# EAGLE design Encoder (EAGLE 6.5.0)
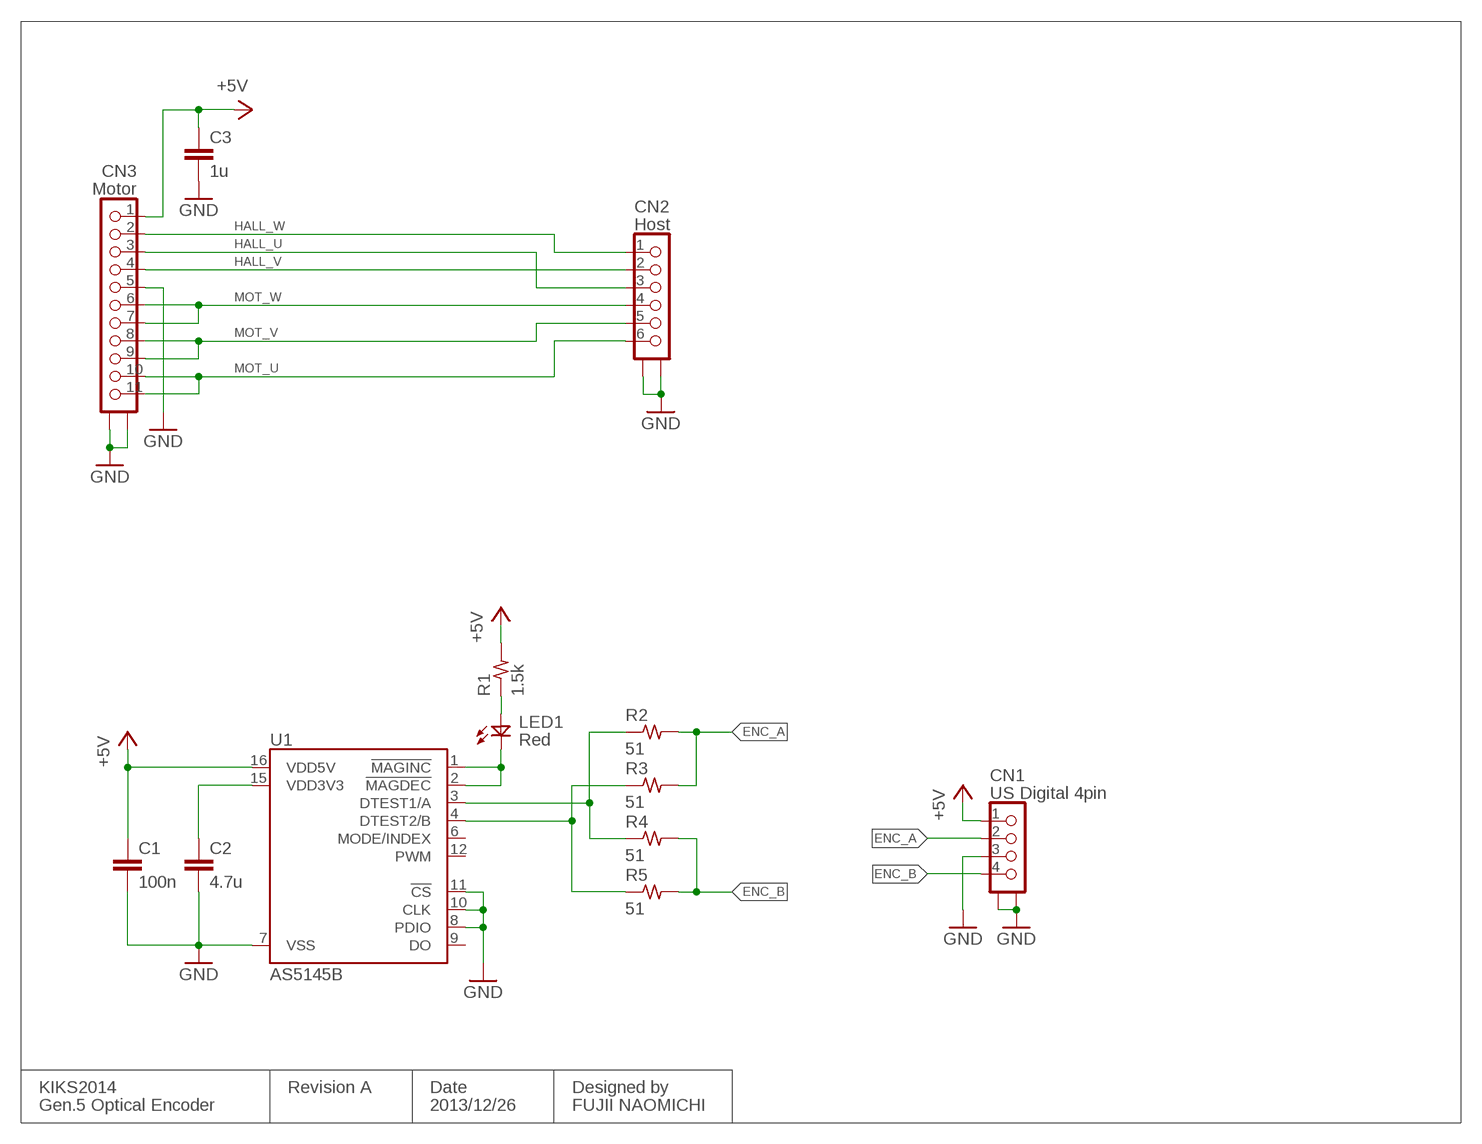
[diagram p0: schematic, sheet 1]

## Parts
C1  100n  C1608  [1608]
C2  4.7u  C1608  [1608]
C3  1u  C1608  [1608]
CN1  US Digital 4pin  53261-0471  [53261-04]
CN2  Host  504050-0691  [504050-0691]
CN3  Motor  52271-1179  [52271-11]
LED1  Red  LED1608  [1608]
R1  1.5k  R1608  [1608]
R2  51  R1608  [1608]
R3  51  R1608  [1608]
R4  51  R1608  [1608]
R5  51  R1608  [1608]
U1  AS5145B  [SSOP16]

## Nets
+5V: C1.1 C3.1 CN1.1 CN3.1 R1.2 U1.16(VDD5V)
ENC_A: CN1.2 R2.2 R3.2
ENC_B: CN1.4 R4.2 R5.2
GND: C1.2 C2.2 C3.2 CN1.3 CN1.S1 CN1.S2 CN2.S1 CN2.S2 CN3.5 CN3.S1 CN3.S2 U1.7(VSS) U1.8(PDIO) U1.10(CLK) U1.11(!CS)
HALL_U: CN2.3 CN3.3
HALL_V: CN2.2 CN3.4
HALL_W: CN2.1 CN3.2
MOT_U: CN2.6 CN3.10 CN3.11
MOT_V: CN2.5 CN3.8 CN3.9
MOT_W: CN2.4 CN3.6 CN3.7
N$1: R2.1 R4.1 U1.3(DTEST1/A)
N$2: C2.1 U1.15(VDD3V3)
N$3: R3.1 R5.1 U1.4(DTEST2/B)
N$5: LED1.K U1.1(!MAGINC) U1.2(!MAGDEC)
N$6: LED1.A R1.1
Unconnected: U1.6(MODE/INDEX) U1.9(DO) U1.12(PWM)

## Notes on the sheet
- KIKS2014 | Revision A | Date | Designed by
- Gen.5 Optical Encoder | 2013/12/26 | FUJII NAOMICHI

## Library data of the parts
C1-C3 = Passive:C
CN1 = con-Molex:53261-0471
CN2 = con-Molex:504050-0691
CN3 = con-Molex:52271-1179
LED1 = Opto:LED
R1-R5 = Passive:R
U1 = ic-ams:AS5145

## Board
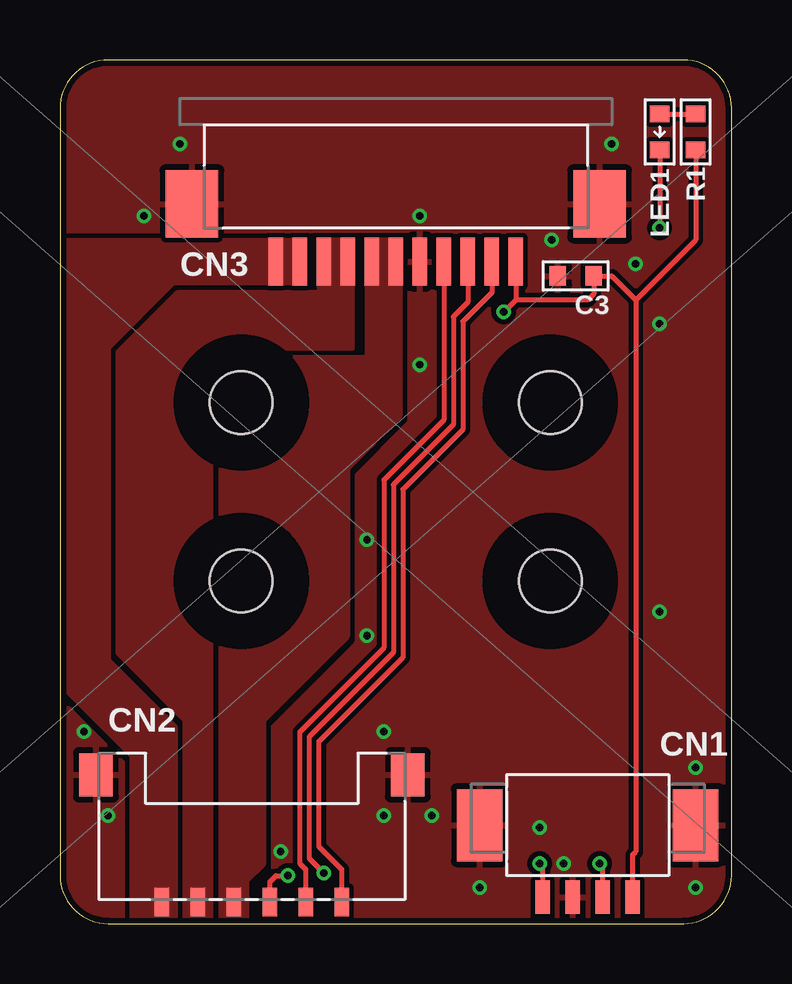
[diagram p1: board, top side]
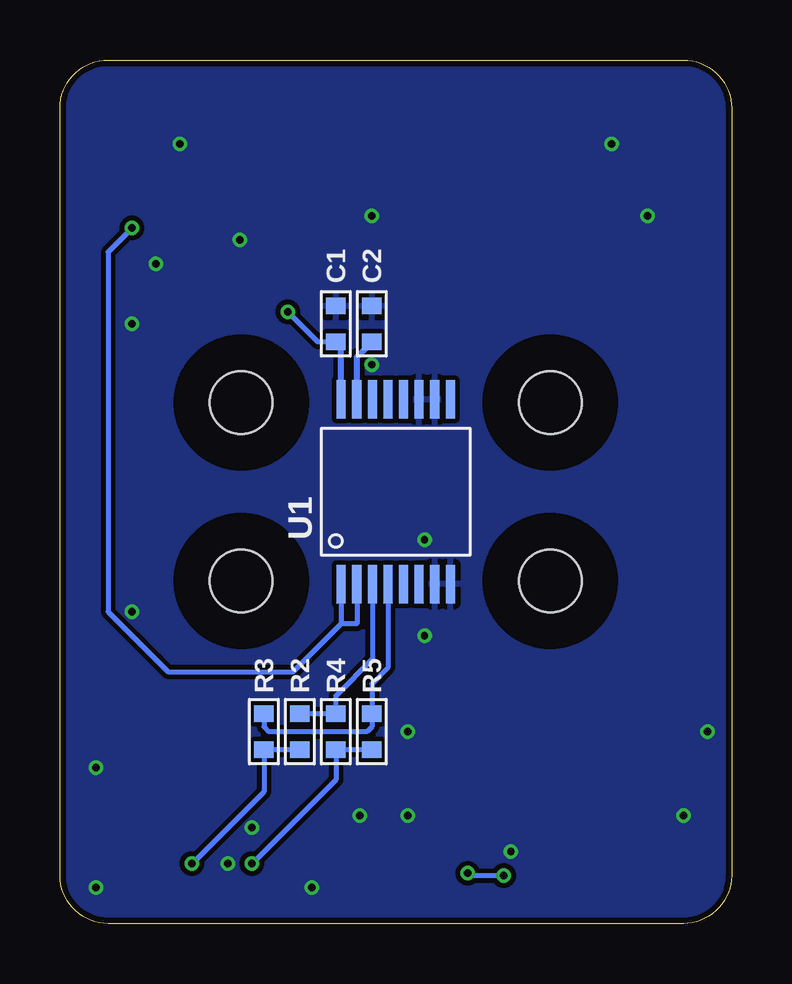
[diagram p2: board, bottom side, seen from below]

Size 28 x 36 mm. Coordinates in mm from the lower left corner, seen from the top.
Outline: 2,0 26,0 arc90 28,2 28,34 arc90 26,36 2,36 arc90 0,34 0,2 arc90 2,0
Copper layers (1*16): Top 0.035mm / dielectric 1.2mm / Bottom 0.035mm
Design rules "seeedstudio *": minimum track width 6mil, minimum drill 0.3mm, track to track 6mil, track to pad 6mil, pad to pad 6mil, via to via 6mil, smd to smd 5mil, copper to edge 10mil, drill to drill 10mil, minimum pad ring 0.2mm, minimum via ring 6mil, stop-mask expansion 4mil, vias tented up to drill 3mm, thermal gap 10mil
Holes 2.6 mm at 7.56,14.28 20.44,21.72 7.56,21.72 20.44,14.28
tKeepout: area 53,-2 to 59,1; area 41,-2 to 44,-1.4; area 68,-2 to 71,-1.4; area 63,0.6 to 66,3.6; area 46,0.6 to 49,3.6
tRestrict: area 5.1,11.8 to 10.1,16.8; area 17.9,19.2 to 22.9,24.2; area 5.1,19.2 to 10.1,24.2; area 17.9,11.8 to 22.9,16.8
bRestrict: area 5.1,11.8 to 10.1,16.8; area 17.9,19.2 to 22.9,24.2; area 5.1,19.2 to 10.1,24.2; area 17.9,11.8 to 22.9,16.8

### Footprints (pad centres in the part's own frame; a part is rotated, then mirrored left to right if it is on the bottom)
1608 = smd 0.7 x 0.8: 1 -0.75,0; 2 0.75,0
53261-04 = smd 0.6 x 1.4: 1 1.875,-1.9; 2 0.625,-1.9; 3 -0.625,-1.9; 4 -1.875,-1.9 | smd 1.9 x 3: S1 4.5,1.1; S2 -4.5,1.1
504050-0691 = smd 0.6 x 1.2: 1 3.75,-0.1; 2 2.25,-0.1; 3 0.75,-0.1; 4 -0.75,-0.1; 5 -2.25,-0.1; 6 -3.75,-0.1 | smd 1.4 x 1.8: S1 6.5,5.2; S2 -6.5,5.2
52271-11 = smd 0.6 x 2: 1 5,-2.4; 2 4,-2.4; 3 3,-2.4; 4 2,-2.4; 5 1,-2.4; 6 0,-2.4; 7 -1,-2.4; 8 -2,-2.4; 9 -3,-2.4; 10 -4,-2.4; 11 -5,-2.4 | smd 2.2 x 2.8: S1 -8.5,0; S2 8.5,0
1608' = smd 0.7 x 0.8: A 0.75,0; K -0.75,0
SSOP16 = smd 0.381 x 1.6: 1 -2.275,-3.85; 2 -1.625,-3.85; 3 -0.975,-3.85; 4 -0.325,-3.85; 5 0.325,-3.85; 6 0.975,-3.85; 7 1.625,-3.85; 8 2.275,-3.85; 9 2.275,3.85; 10 1.625,3.85; 11 0.975,3.85; 12 0.325,3.85; 13 -0.325,3.85; 14 -0.975,3.85; 15 -1.625,3.85; 16 -2.275,3.85

### Placement (x,y rotation side)
C1  16.5,25 90 bottom
C2  15,25 90 bottom
C3  21.5,27 180 top
CN1  22,3 0 top
CN2  8,1 0 top
CN3  14,30 0 top
LED1  Red  [1608']  25,33 90 top
R1  26.5,33 270 top
R2  18,8 270 bottom
R3  19.5,8 270 bottom
R4  16.5,8 270 bottom
R5  15,8 270 bottom
U1  14,18 0 bottom

### Tracks (layer width: path | path; a pad name or v marks a point on that pad's centre or on a via)
+5V  (via drill 0.3)
  Top 0.2: 24,26 24,3 23.88,2.88 CN1.1 | R1.2 26.5,28.5 24,26 | 24,26 23,27 C3.1 22.25,26.25 22,26 19,26 | 19,26 v18.5,25.5 | CN3.1 19,26
  Bottom 0.2: C1.1 17.25,24.25 v18.5,25.5
  Bottom 0.25: U1.16 16.27,24.02 C1.1
ENC_A  (via drill 0.3)
  Top 0.2: CN1.2 22.62,2.38 v22.5,2.5
  Bottom 0.2: R2.2 R3.2 19.5,5.5 v22.5,2.5
ENC_B  (via drill 0.3)
  Top 0.2: CN1.4 20.12,2.38 v20,2.5
  Bottom 0.2: R5.2 R4.2 16.5,6 v20,2.5
GND  (via drill 0.3)
  other vias: 15,23.3 21,2.5 20,4 26.5,6.5 26.5,1.5 17.5,1.5 15.5,4.5 13.5,8 1,8 2,4.5 13.5,4.5 9.2,3 12.8,12 12.8,16 5,32.5 3.5,29.5 23,32.5 24,27.5 20.5,28.5 15,29.5 25,25 25,13
  pour Top (isolate 0.2, rank 6): -1,37 29,37 29,-1 -1,-1
  pour Bottom (isolate 0.2, rank 6): -1,37 29,37 29,-1 -1,-1
HALL_U  (via drill 0.3)
  Top 0.2: CN3.3 17,25.9 16.4,25.3 16.4,20.8 13.9,18.3 13.9,11.3 10.4,7.8 10.4,2.7 v11,2.1 | CN2.3 8.75,1.75 9,2 v9.5,2
  Bottom 0.2: v9.5,2 10.9,2 v11,2.1
HALL_V
  Top 0.2: CN3.4 16,21 13.5,18.5 13.5,11.5 10,8 10,2.5 10.25,2.25 CN2.2
HALL_W
  Top 0.2: CN3.2 18,26.3 16.8,25.1 16.8,20.6 14.3,18.1 14.3,11.1 10.8,7.6 10.8,3.2 11.75,2.25 CN2.1
MOT_U
  pour Top (isolate 0.2, no thermals): 10.2,28.5 10.2,26.7 4.7,26.7 2,24 2,11 4.8,8.2 4.8,0 3,0 3,7 0,10 0,28.5
MOT_V
  pour Top (isolate 0.2, no thermals): 10.8,28.5 10.8,26.3 4.9,26.3 2.4,23.8 2.4,11.3 5.2,8.5 5.2,0 6.3,0 6.3,24 12.2,24 12.2,28.5
MOT_W
  pour Top (isolate 0.2, no thermals): 12.8,28.5 12.8,23.6 6.7,23.6 6.7,0 7.8,0 7.8,1.8 8.5,2.5 8.5,8.5 12,12 12,19 14.2,21.2 14.2,28.5
N$1
  Bottom 0.2: U1.3 14.98,11.03 16.5,9.5 R4.1 R2.1
N$2
  Bottom 0.25: U1.15 15.62,23.62 C2.1
N$3
  Bottom 0.2: U1.4 14.32,10.68 15,10 R5.1 15,8.2 15.2,8 19.3,8 19.5,8.2 R3.1
N$5  (via drill 0.3)
  Top 0.2: LED1.K v25,29
  Bottom 0.2: U1.2 15.62,12.5 16.27,12.5 | U1.1 16.27,12.5 | v25,29 26,28 26,13 23.5,10.5 18.27,10.5 16.27,12.5
N$6
  Top 0.2: LED1.A R1.1